# EAGLE design controllerplatine (EAGLE 9.6.2)

## Sheet 1 of 2
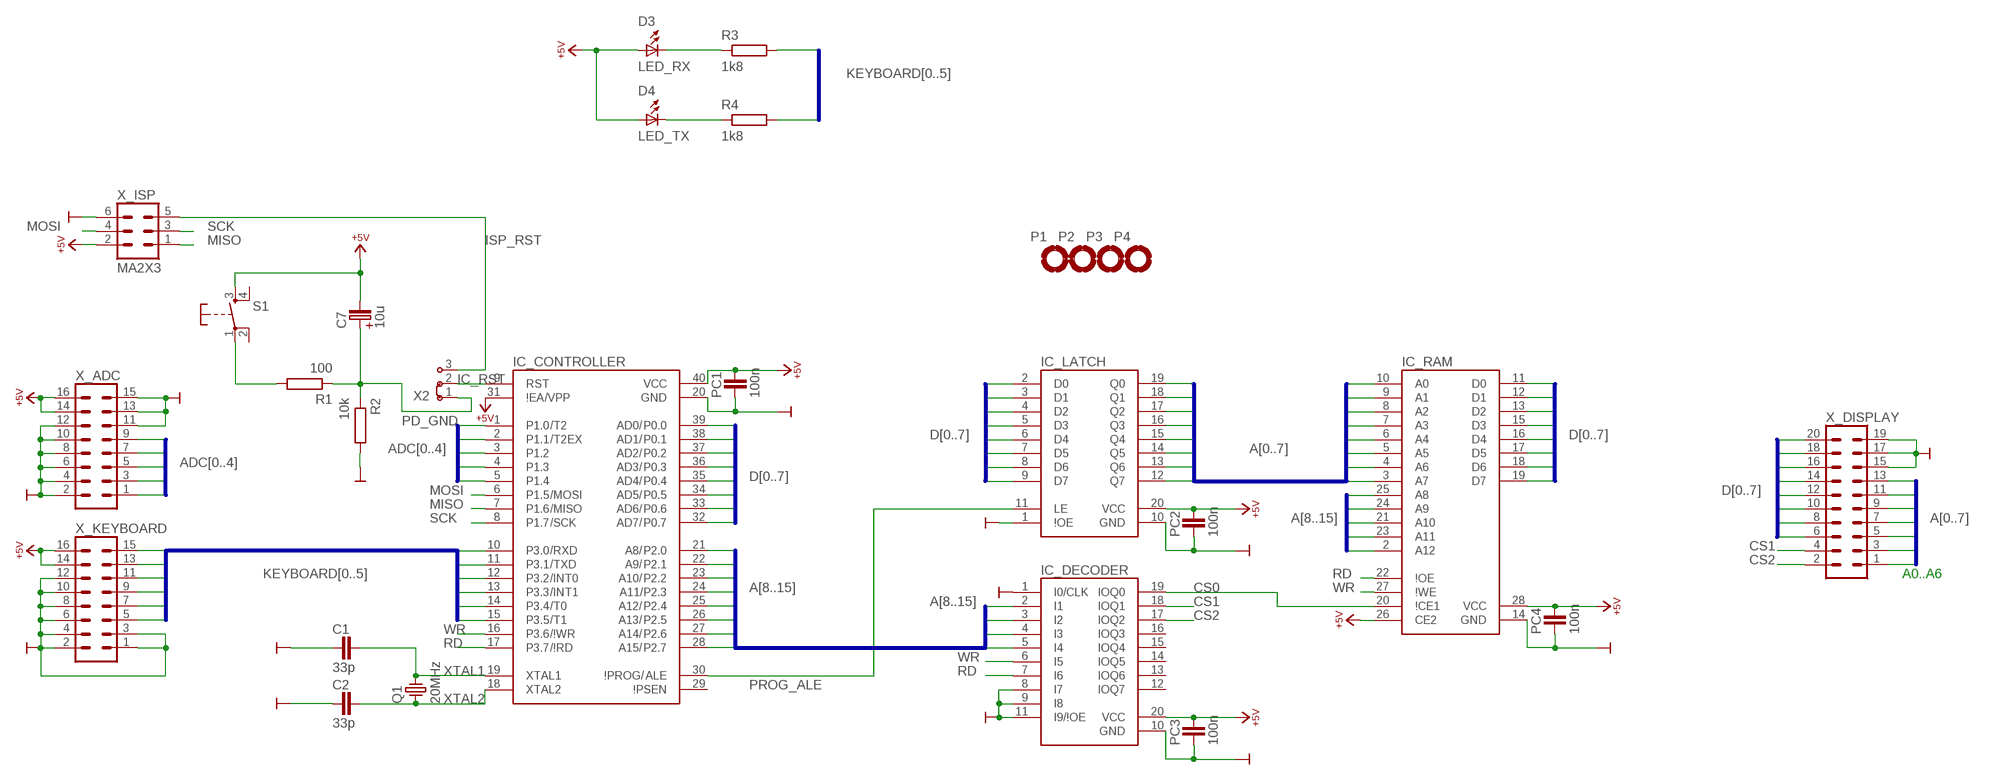
[diagram p0: schematic, sheet 1]

### Parts
C1  33p  C-2,5  [C-2,5]
C2  33p  C-2,5  [C-2,5]
C7  10u  ELKO-2,5  [ELKO-2,5]
D3  LED_RX  LED3-2,5  [LED3-2,5]
D4  LED_TX  LED3-2,5  [LED3-2,5]
IC_CONTROLLER  AT89S52  [DIL40]
IC_DECODER  16V8  [DIL20]
IC_LATCH  74573  [DIL20]
IC_RAM  6264  [DIL28]
P1  MPAD-3,0  [MPAD-3,0]
P2  MPAD-3,0  [MPAD-3,0]
P3  MPAD-3,0  [MPAD-3,0]
P4  MPAD-3,0  [MPAD-3,0]
PC1  100n  C-2,5  [C-2,5]
PC2  100n  C-2,5  [C-2,5]
PC3  100n  C-2,5  [C-2,5]
PC4  100n  C-2,5  [C-2,5]
Q1  20MHz  Q-HC49U  [HC49U]
R1  100  R-10  [R-10]
R2  10k  R-10  [R-10]
R3  1k8  R-10_LANG  [R-10_LANG]
R4  1k8  R-10_LANG  [R-10_LANG]
S1  KEY-3301  [T3301]
X2  J1X3  [J1X3]
X_ADC  MA8X2  [MA8X2]
X_DISPLAY  MA10X2  [MA10X2]
X_ISP  MA2X3  MA3X2  [MA3X2]
X_KEYBOARD  MA8X2  [MA8X2]

### Nets
+5V: C7.- D3.A D4.A IC_CONTROLLER.31(\!EA) IC_CONTROLLER.40(VCC) IC_DECODER.20(VCC) IC_LATCH.20(VCC) IC_RAM.26(CE2) IC_RAM.28(VCC) PC1.2 PC2.2 PC3.2 PC4.2 S1.3(S) X_ADC.14 X_ADC.16 X_ISP.2 X_KEYBOARD.14 X_KEYBOARD.16 ; also sheet 2
A0: IC_LATCH.19(Q0) IC_RAM.10(A0) X_DISPLAY.13
A1: IC_LATCH.18(Q1) IC_RAM.9(A1) X_DISPLAY.11
A2: IC_LATCH.17(Q2) IC_RAM.8(A2) X_DISPLAY.9
A3: IC_LATCH.16(Q3) IC_RAM.7(A3) X_DISPLAY.7
A4: IC_LATCH.15(Q4) IC_RAM.6(A4) X_DISPLAY.5
A5: IC_LATCH.14(Q5) IC_RAM.5(A5) X_DISPLAY.3
A6: IC_LATCH.13(Q6) IC_RAM.4(A6) X_DISPLAY.1
A7: IC_LATCH.12(Q7) IC_RAM.3(A7)
A8: IC_CONTROLLER.21(P2.0) IC_RAM.25(A8)
A9: IC_CONTROLLER.22(P2.1) IC_RAM.24(A9)
A10: IC_CONTROLLER.23(P2.2) IC_RAM.21(A10)
A11: IC_CONTROLLER.24(P2.3) IC_RAM.23(A11)
A12: IC_CONTROLLER.25(P2.4) IC_DECODER.5(I4) IC_RAM.2(A12)
A13: IC_CONTROLLER.26(P2.5) IC_DECODER.4(I3)
A14: IC_CONTROLLER.27(P2.6) IC_DECODER.3(I2)
A15: IC_CONTROLLER.28(P2.7) IC_DECODER.2(I1)
ADC0: IC_CONTROLLER.1(P1.0) X_ADC.9
ADC1: IC_CONTROLLER.2(P1.1) X_ADC.7
ADC2: IC_CONTROLLER.3(P1.2) X_ADC.5
ADC3: IC_CONTROLLER.4(P1.3) X_ADC.3
ADC4: IC_CONTROLLER.5(P1.4) X_ADC.1
CS0: IC_DECODER.19(IOQ0) IC_RAM.20(\!CE1)
CS1: IC_DECODER.18(IOQ1) X_DISPLAY.4
CS2: IC_DECODER.17(IOQ2) X_DISPLAY.2
D0: IC_CONTROLLER.39(P0.0) IC_LATCH.2(D0) IC_RAM.11(D0) X_DISPLAY.20
D1: IC_CONTROLLER.38(P0.1) IC_LATCH.3(D1) IC_RAM.12(D1) X_DISPLAY.18
D2: IC_CONTROLLER.37(P0.2) IC_LATCH.4(D2) IC_RAM.13(D2) X_DISPLAY.16
D3: IC_CONTROLLER.36(P0.3) IC_LATCH.5(D3) IC_RAM.15(D3) X_DISPLAY.14
D4: IC_CONTROLLER.35(P0.4) IC_LATCH.6(D4) IC_RAM.16(D4) X_DISPLAY.12
D5: IC_CONTROLLER.34(P0.5) IC_LATCH.7(D5) IC_RAM.17(D5) X_DISPLAY.10
D6: IC_CONTROLLER.33(P0.6) IC_LATCH.8(D6) IC_RAM.18(D6) X_DISPLAY.8
D7: IC_CONTROLLER.32(P0.7) IC_LATCH.9(D7) IC_RAM.19(D7) X_DISPLAY.6
GND: C1.1 C2.1 IC_CONTROLLER.20(GND) IC_DECODER.1(I0/CLK) IC_DECODER.8(I7) IC_DECODER.9(I8) IC_DECODER.10(GND) IC_DECODER.11(I9/\!OE) IC_LATCH.1(\!OE) IC_LATCH.10(GND) IC_RAM.14(GND) PC1.1 PC2.1 PC3.1 PC4.1 R2.2 X_ADC.2 X_ADC.4 X_ADC.6 X_ADC.8 X_ADC.10 X_ADC.11 X_ADC.12 X_ADC.13 X_ADC.15 X_DISPLAY.15 X_DISPLAY.17 X_DISPLAY.19 X_ISP.6 X_KEYBOARD.1 X_KEYBOARD.2 X_KEYBOARD.3 X_KEYBOARD.4 X_KEYBOARD.6 X_KEYBOARD.8 X_KEYBOARD.10 X_KEYBOARD.12 ; also sheet 2
IC_RST: IC_CONTROLLER.9(RST) X2.2
ISP_RST: X2.3 X_ISP.5
KEYBOARD0: IC_CONTROLLER.10(P3.0) R3.2 X_KEYBOARD.15
KEYBOARD1: IC_CONTROLLER.11(P3.1) R4.2 X_KEYBOARD.13
KEYBOARD2: IC_CONTROLLER.12(P3.2) X_KEYBOARD.11
KEYBOARD3: IC_CONTROLLER.13(P3.3) X_KEYBOARD.9
KEYBOARD4: IC_CONTROLLER.14(P3.4) X_KEYBOARD.7
KEYBOARD5: IC_CONTROLLER.15(P3.5) X_KEYBOARD.5
MISO: IC_CONTROLLER.7(P1.6) X_ISP.1
MOSI: IC_CONTROLLER.6(P1.5) X_ISP.4
N$7: R1.2 S1.1(P)
N$11: D3.C R3.1
N$12: D4.C R4.1
PD_GND: C7.+ R1.1 R2.1 X2.1
PROG_ALE: IC_CONTROLLER.30(ALE) IC_LATCH.11(LE)
RD: IC_CONTROLLER.17(P3.7) IC_DECODER.7(I6) IC_RAM.22(\!OE)
SCK: IC_CONTROLLER.8(P1.7) X_ISP.3
WR: IC_CONTROLLER.16(P3.6) IC_DECODER.6(I5) IC_RAM.27(\!WE)
XTAL1: C1.2 IC_CONTROLLER.19(XTAL1) Q1.2
XTAL2: C2.2 IC_CONTROLLER.18(XTAL2) Q1.1
Unconnected: IC_CONTROLLER.29(\!PSEN) IC_DECODER.12(IOQ7) IC_DECODER.13(IOQ6) IC_DECODER.14(IOQ5) IC_DECODER.15(IOQ4) IC_DECODER.16(IOQ3) P1.B3,0(MOUNT) P2.B3,0(MOUNT) P3.B3,0(MOUNT) P4.B3,0(MOUNT) S1.2(P) S1.4(S)

### Buses
D[0..7]
A[8..15]
A[0..7]
KEYBOARD[0..5]
ADC[0..4]

### Notes on the sheet
- A0..A6

## Sheet 2 of 2: Spannungsversorgung
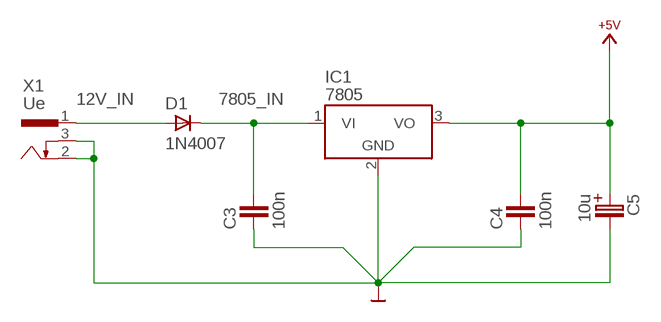
[diagram p1: schematic, sheet 2]

### Parts
C3  100n  C-2,5  [C-2,5]
C4  100n  C-2,5  [C-2,5]
C5  10u  ELKO-2,5  [ELKO-2,5]
D1  1N4007  1N4007-10  [DO41-10]
IC1  7805  [TO220V]
X1  Ue  PWRCON-HEBW21  [HEBW21]

### Nets
12V_IN: D1.A X1.1
7805_IN: C3.2 D1.C IC1.1(VI)
+5V: C4.2 C5.+ IC1.3(VO) ; also sheet 1
GND: C3.1 C4.1 C5.- IC1.2(GND) X1.2 X1.3 ; also sheet 1

## Library data of the parts
C1-C4 PC1-PC4 = 89S52mini:C-2,5
C5 C7 = 89S52mini:ELKO-2,5
D1 = 89S52mini:1N4007-10
D3 D4 = 89S52mini:LED3-2,5
IC1 = 89S52mini:7805
IC_CONTROLLER = 89S52mini:AT89S52
IC_DECODER = 89S52mini:16V8
IC_LATCH = 89S52mini:74573
IC_RAM = 89S52mini:6264
P1-P4 = 89S52mini:MPAD-3,0
Q1 = 89S52mini:Q-HC49U
R1 R2 = 89S52mini:R-10
R3 R4 = 89S52mini:R-10_LANG
S1 = 89S52mini:KEY-3301
X1 = 89S52mini:PWRCON-HEBW21
X2 = 89S52mini:J1X3
X_ADC X_KEYBOARD = 89S52mini:MA8X2
X_DISPLAY = 89S52mini:MA10X2
X_ISP = 89S52mini:MA3X2

## Board
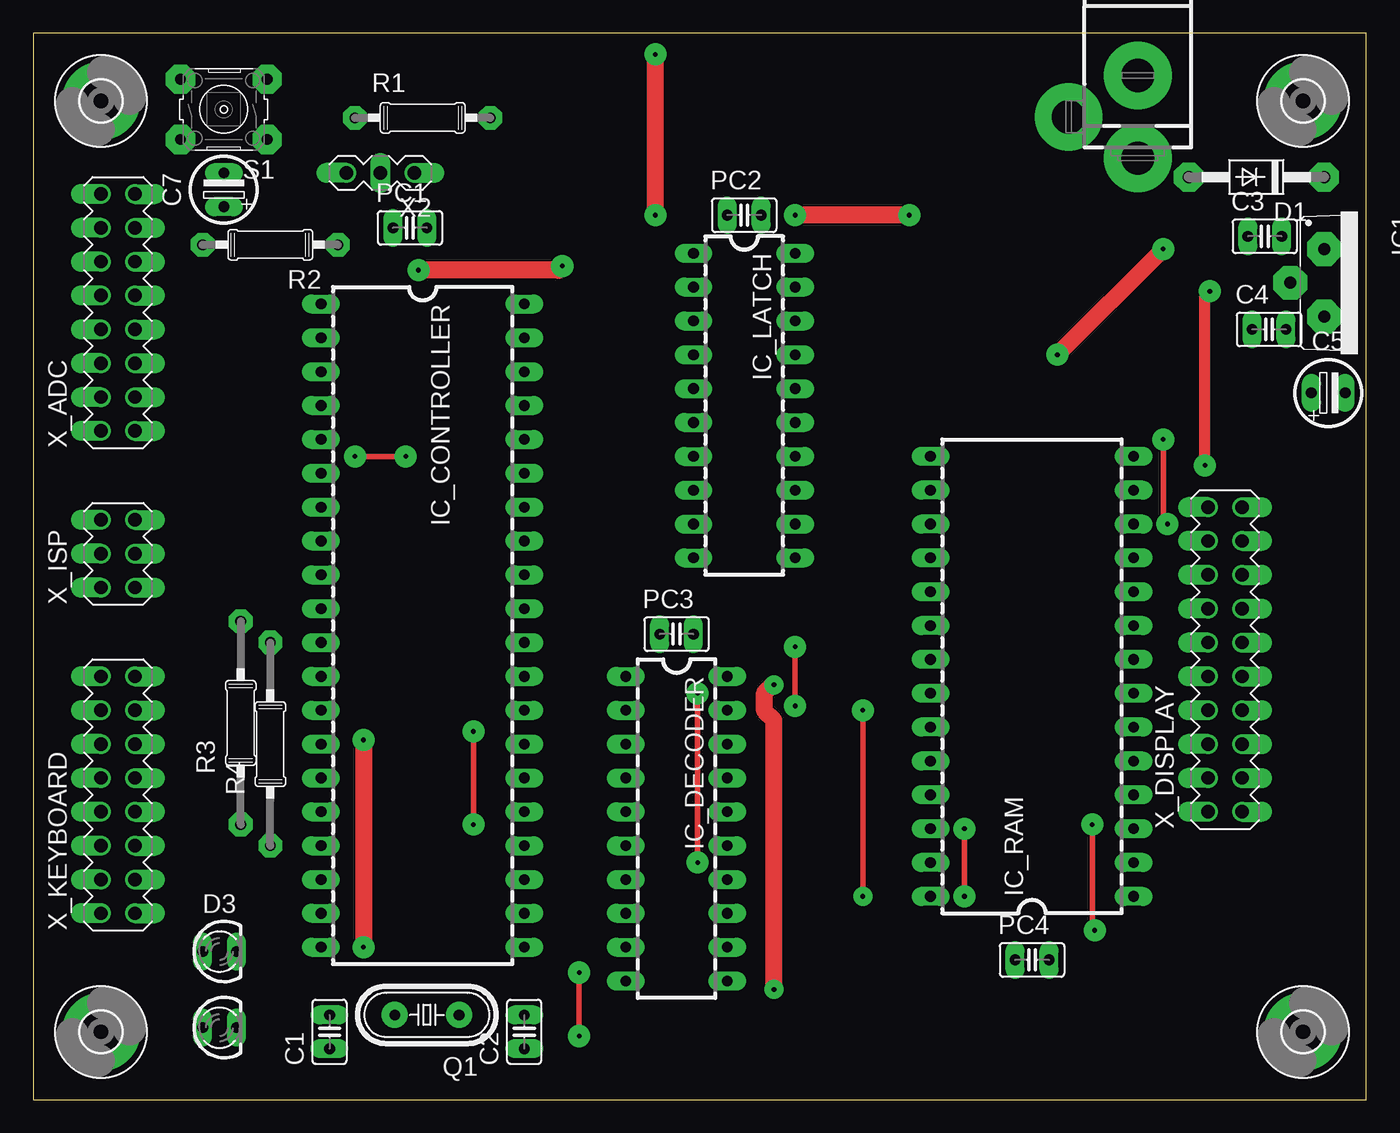
[diagram p2: board, top side]
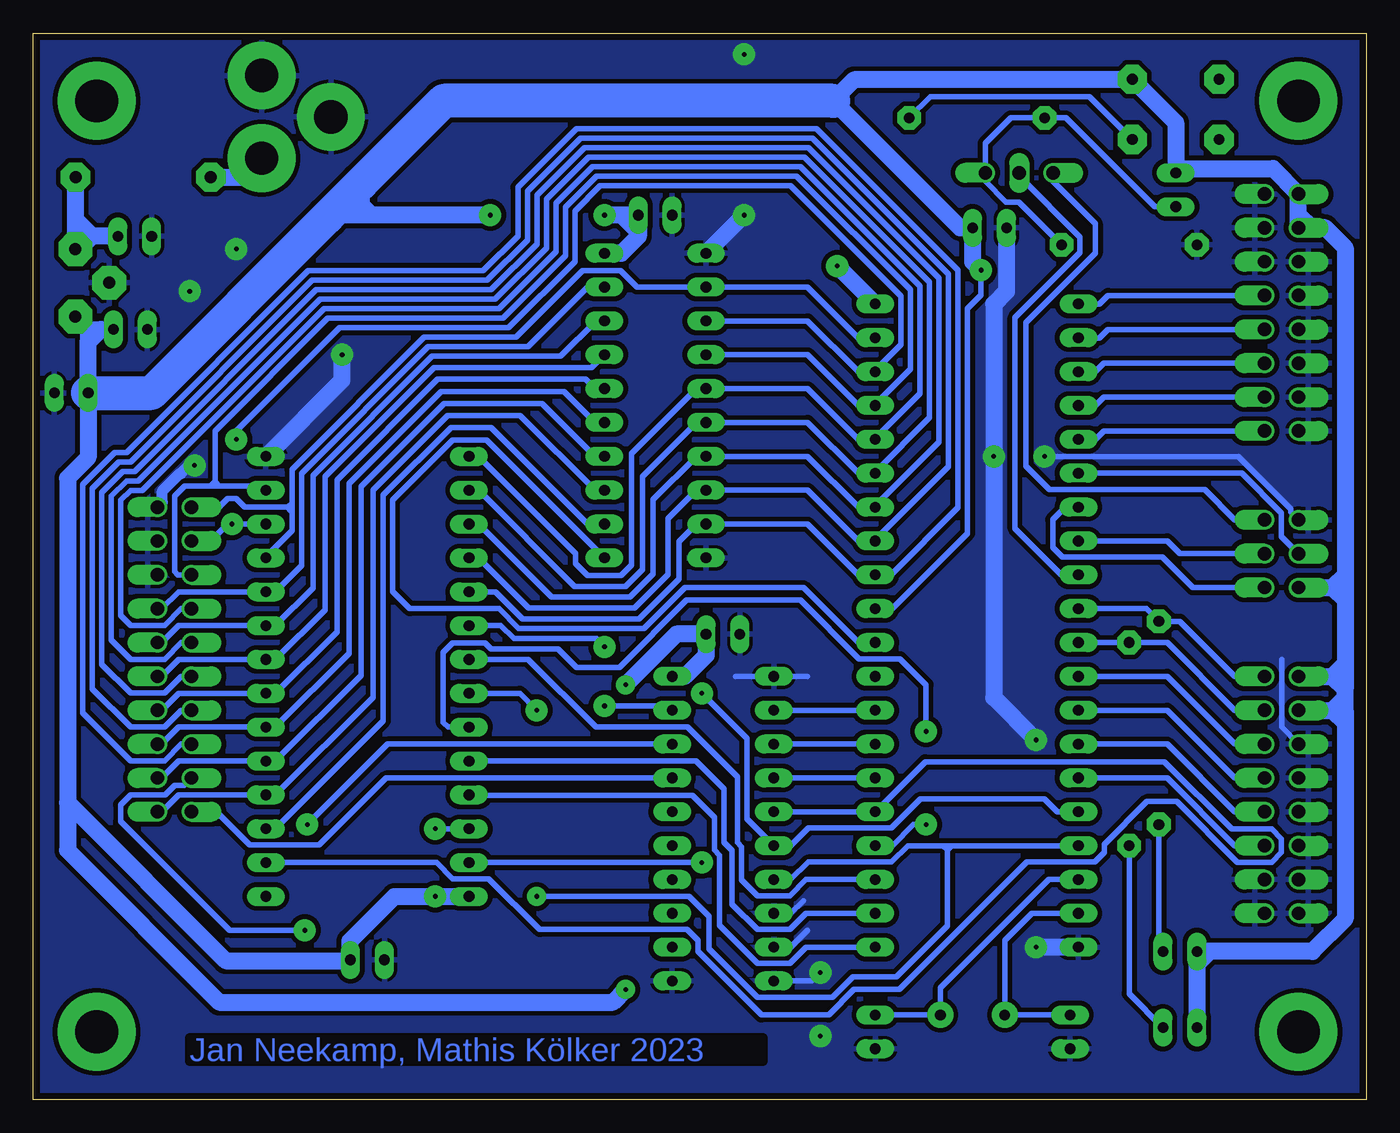
[diagram p3: board, bottom side, seen from below]

Size 100 x 80 mm. Coordinates in mm from the lower left corner, seen from the top.
Outline: 0,0 100,0 100,80 0,80 0,0
Copper layers (1*16): Top 0.035mm / dielectric 1.5mm / Bottom 0.035mm
Design rules "default *": minimum track width 16mil, minimum drill 0.35mm, track to track 12mil, track to pad 12mil, pad to pad 12mil, via to via 16mil, smd to smd 6mil, copper to edge 20mil, drill to drill 6mil, minimum pad ring 10mil, minimum via ring 8mil, stop-mask expansion 4mil, vias tented up to drill 0mil, thermal gap 10mil

### Footprints (pad centres in the part's own frame; a part is rotated, then mirrored left to right if it is on the bottom)
C-2,5 = drill 0.8 pad 1.422 long: 1 -1.27,0; 2 1.27,0
ELKO-2,5 = drill 0.8 pad 1.422 long: + -1.27,0; - 1.27,0
DO41-10 = drill 0.9 pad 2.184 octagon: A 5.08,0; C -5.08,0
LED3-2,5 = drill 0.8 pad 1.422 long: A -1.27,0; C 1.27,0
TO220V = drill 0.9 pad 2.54 octagon: 1 -2.54,0; 2 0,-2.54; 3 2.54,0
DIL40 = drill 0.8 pad 1.422 long: 1 -24.13,-7.62; 2 -21.59,-7.62; 3 -19.05,-7.62; 4 -16.51,-7.62; 5 -13.97,-7.62; 6 -11.43,-7.62; 7 -8.89,-7.62; 8 -6.35,-7.62; 9 -3.81,-7.62; 10 -1.27,-7.62; 11 1.27,-7.62; 12 3.81,-7.62; 13 6.35,-7.62; 14 8.89,-7.62; 15 11.43,-7.62; 16 13.97,-7.62; 17 16.51,-7.62; 18 19.05,-7.62; 19 21.59,-7.62; 20 24.13,-7.62; 21 24.13,7.62; 22 21.59,7.62; 23 19.05,7.62; 24 16.51,7.62; 25 13.97,7.62; 26 11.43,7.62; 27 8.89,7.62; 28 6.35,7.62; 29 3.81,7.62; 30 1.27,7.62; 31 -1.27,7.62; 32 -3.81,7.62; 33 -6.35,7.62; 34 -8.89,7.62; 35 -11.43,7.62; 36 -13.97,7.62; 37 -16.51,7.62; 38 -19.05,7.62; 39 -21.59,7.62; 40 -24.13,7.62
DIL20 = drill 0.8 pad 1.422 long: 1 -11.43,-3.81; 2 -8.89,-3.81; 3 -6.35,-3.81; 4 -3.81,-3.81; 5 -1.27,-3.81; 6 1.27,-3.81; 7 3.81,-3.81; 8 6.35,-3.81; 9 8.89,-3.81; 10 11.43,-3.81; 11 11.43,3.81; 12 8.89,3.81; 13 6.35,3.81; 14 3.81,3.81; 15 1.27,3.81; 16 -1.27,3.81; 17 -3.81,3.81; 18 -6.35,3.81; 19 -8.89,3.81; 20 -11.43,3.81
DIL28 = drill 0.8 pad 1.422 long: 1 -16.51,-7.62; 2 -13.97,-7.62; 3 -11.43,-7.62; 4 -8.89,-7.62; 5 -6.35,-7.62; 6 -3.81,-7.62; 7 -1.27,-7.62; 8 1.27,-7.62; 9 3.81,-7.62; 10 6.35,-7.62; 11 8.89,-7.62; 12 11.43,-7.62; 13 13.97,-7.62; 14 16.51,-7.62; 15 16.51,7.62; 16 13.97,7.62; 17 11.43,7.62; 18 8.89,7.62; 19 6.35,7.62; 20 3.81,7.62; 21 1.27,7.62; 22 -1.27,7.62; 23 -3.81,7.62; 24 -6.35,7.62; 25 -8.89,7.62; 26 -11.43,7.62; 27 -13.97,7.62; 28 -16.51,7.62
MPAD-3,0 = drill 3.2 pad 5.842: B3,0 0,0
HC49U = drill 0.8 pad 1.93: 1 -2.413,0; 2 2.413,0
R-10 = drill 0.8 pad 1.778 octagon: 1 -5.08,0; 2 5.08,0
R-10_LANG = drill 0.8 pad 1.778 octagon: 1 -7.62,0; 2 7.62,0
T3301 = drill 0.8 pad 2.184 octagon: 1 -3.251,2.261; 2 3.251,2.261; 3 -3.251,-2.261; 4 3.251,-2.261
HEBW21 = drill 2.5 pad 5.08: 1 6.2,0; 2 3.1,-5.2; 3 0,0
J1X3 = drill 1 pad 1.422 offset: 1 -2.54,0; 3 2.54,0 | drill 1 pad 1.422 long: 2 0,0
MA8X2 = drill 1 pad 1.422 offset: 1 -8.89,-1.27; 2 -8.89,1.27; 3 -6.35,-1.27; 4 -6.35,1.27; 5 -3.81,-1.27; 6 -3.81,1.27; 7 -1.27,-1.27; 8 -1.27,1.27; 9 1.27,-1.27; 10 1.27,1.27; 11 3.81,-1.27; 12 3.81,1.27; 13 6.35,-1.27; 14 6.35,1.27; 15 8.89,-1.27; 16 8.89,1.27
MA10X2 = drill 1 pad 1.422 offset: 1 -11.43,-1.27; 2 -11.43,1.27; 3 -8.89,-1.27; 4 -8.89,1.27; 5 -6.35,-1.27; 6 -6.35,1.27; 7 -3.81,-1.27; 8 -3.81,1.27; 9 -1.27,-1.27; 10 -1.27,1.27; 11 1.27,-1.27; 12 1.27,1.27; 13 3.81,-1.27; 14 3.81,1.27; 15 6.35,-1.27; 16 6.35,1.27; 17 8.89,-1.27; 18 8.89,1.27; 19 11.43,-1.27; 20 11.43,1.27
MA3X2 = drill 1 pad 1.422 offset: 1 -2.54,-1.27; 2 -2.54,1.27; 3 0,-1.27; 4 0,1.27; 5 2.54,-1.27; 6 2.54,1.27

### Placement (x,y rotation side)
C1  22.23,5.08 90 top
C2  36.83,5.08 90 top
C3  92.39,64.77 0 top
C4  92.71,57.78 0 top
C5  97.16,53.02 0 top
C7  14.29,68.26 90 top
D1  91.76,69.22 180 top
D3  13.97,11.11 0 top
D4  13.97,5.4 0 top
IC1  96.84,61.28 270 top
IC_CONTROLLER  29.21,35.56 270 top
IC_DECODER  48.26,20.32 270 top
IC_LATCH  53.34,52.07 270 top
IC_RAM  74.93,31.75 90 top
P1  95.25,5.08 0 top
P2  5.08,5.08 0 top
P3  5.08,74.93 0 top
P4  95.25,74.93 0 top
PC1  28.26,65.41 0 top
PC2  53.34,66.36 0 top
PC3  48.26,34.92 0 top
PC4  74.93,10.48 0 top
Q1  29.53,6.35 180 top
R1  29.21,73.66 0 top
R2  17.78,64.14 180 top
R3  15.56,28.26 90 top
R4  17.78,26.67 90 top
S1  14.29,74.3 180 top
X1  82.87,76.83 270 top
X2  26.04,69.53 180 top
X_ADC  6.35,59.05 90 top
X_DISPLAY  89.41,33.02 90 top
X_ISP  6.35,40.96 90 top
X_KEYBOARD  6.35,22.86 90 top

### Tracks (layer width: path | path; a pad name or v marks a point on that pad's centre or on a via)
12V_IN
  Bottom 1.27: D1.A 84.29,69.22 X1.1
7805_IN
  Bottom 1.27: D1.C 96.84,66.04 | 96.84,66.04 96.84,64.77 | 96.84,64.77 IC1.1 96.52,63.82 95.57,64.77 | C3.2 95.57,64.77 | 96.84,64.77 95.57,64.77 | 96.84,66.04 95.57,64.77
+5V  (via drill 0.35 pad 1.42, 0.35 pad 1.65)
  Top 0.406: v69.85,20.32 v69.85,15.24
  Top 1.27: v39.69,62.55 39.37,62.23 v28.89,62.23 | v65.72,66.36 v57.15,66.36 | v55.56,8.26 55.56,28.46 54.86,29.16 54.86,30.53 55.45,31.11 v55.56,31.11
  Bottom 0.406: v69.85,20.32 IC_RAM.26 | v28.89,62.23 28.89,60.35 29.91,59.34 29.91,42.48 35.56,36.83 IC_CONTROLLER.31
  Bottom 1.27: IC1.3 95.89,57.78 | 95.89,57.78 94.93,57.78 | 94.93,57.78 C4.2 | 95.89,56.83 C5.+ 95.89,48.17 97.44,46.62 97.44,22.29 | 95.89,57.78 95.89,56.83 | 94.93,57.78 95.89,56.83 | 5.08,66.36 X_ADC.14 4.13,65.41 | 5.08,66.36 X_ADC.16 6.99,69.85 13.97,69.85 C7.- 14.29,73.3 S1.3 17.58,76.52 38.42,76.52 40.01,74.93 30.48,65.41 PC1.2 29.53,62.87 v28.89,62.23 | 1.59,39.37 1.59,63.91 3.08,65.41 4.13,65.41 | 1.59,39.37 1.59,38.42 | 1.59,38.42 1.59,37.47 | X_ISP.2 2.54,38.42 | 2.54,38.42 1.59,38.42 | 1.59,39.37 2.54,38.42 | 2.54,38.42 1.59,37.47 | 5.08,66.36 4.13,65.41 | 1.59,37.47 1.59,32.7 | 1.59,32.7 1.59,31.75 | 1.59,31.75 1.59,30.8 | 1.59,29.21 1.59,30.16 | 1.59,29.21 1.59,28.26 | 1.59,28.26 1.59,13.56 4.03,11.11 11.75,11.11 | 1.59,31.75 2.54,31.75 | X_KEYBOARD.16 2.54,31.75 | 1.59,29.21 2.54,29.21 | X_KEYBOARD.14 2.54,29.21 | 2.54,29.21 1.59,30.16 | 1.59,30.16 1.59,30.8 | 1.59,30.8 2.54,31.75 | 2.54,31.75 1.59,32.7 | 2.54,29.21 1.59,28.26 | 11.75,11.11 D3.A 12.7,10.16 | 12.7,10.16 D4.A | 11.75,11.11 12.7,10.16 | IC_CONTROLLER.40 v39.69,62.55 | 54.61,65.41 PC2.2 55.88,66.36 | 54.61,65.41 54.61,64.77 55.88,63.5 IC_LATCH.20 | 55.88,66.36 v57.15,66.36 | 55.88,66.36 54.93,65.41 54.61,65.41 | v65.72,66.36 74.61,66.36 | IC_RAM.28 v69.85,15.24 72.9,15.24 76.26,11.87 76.26,10.54 PC4.2 76.2,10.41 85.56,10.41 97.44,22.29 | IC_DECODER.20 51.12,31.75 49.53,33.34 PC3.2 51.75,34.92 v55.56,31.11 | v55.56,8.26 56.52,7.3 86.04,7.3 97.44,18.7 97.44,22.29 | 75.41,68.74 75.41,67.15 74.61,66.36 | 74.61,66.36 77.79,66.36 77.95,66.2
  Bottom 2.54: C5.+ 91.12,53.02 77.95,66.2 75.41,68.74 69.22,74.93 40.01,74.93
A0
  Bottom 0.406: X_DISPLAY.13 90.36,36.83 89.09,38.1 IC_RAM.10 81.84,38.1 79.88,40.06 79.88,46.98 70.37,56.49 62.89,56.49 58.42,60.96 IC_LATCH.19
A1
  Bottom 0.406: X_DISPLAY.11 90.36,34.29 89.09,35.56 IC_RAM.9 81.84,35.56 79.02,38.38 79.02,46.83 70.08,55.78 60.43,55.78 57.78,58.42 IC_LATCH.18
A2
  Bottom 0.406: X_DISPLAY.9 90.36,31.75 89.09,33.02 IC_RAM.8 81.84,33.02 78.12,36.74 78.12,46.73 69.92,54.93 58.1,54.93 IC_LATCH.17
A3
  Bottom 0.406: IC_LATCH.16 57.86,53.34 58.56,54.04 69.66,54.04 77.22,46.48 77.22,35.1 81.84,30.48 IC_RAM.7 89.09,30.48 90.36,29.21 X_DISPLAY.7
A4
  Bottom 0.406: IC_LATCH.15 57.86,50.8 60.2,53.14 69.41,53.14 76.32,46.23 76.32,33.46 81.84,27.94 IC_RAM.6 89.09,27.94 90.36,26.67 X_DISPLAY.5
A5
  Bottom 0.406: IC_LATCH.14 57.86,48.26 61.84,52.23 69.17,52.23 75.42,45.98 75.42,31.82 81.84,25.4 IC_RAM.5 89.09,25.4 90.36,24.13 X_DISPLAY.3
A6
  Bottom 0.406: IC_LATCH.13 57.86,45.72 63.48,51.33 68.92,51.33 74.52,45.73 74.52,30.18 81.84,22.86 IC_RAM.4 89.09,22.86 90.36,21.59 X_DISPLAY.1
A7
  Bottom 0.406: IC_RAM.3 81.84,20.32 73.75,28.41 73.75,45.35 68.67,50.43 65.67,50.43 58.42,43.18 IC_LATCH.12
A8
  Bottom 0.406: IC_CONTROLLER.21 42.02,11.43 43.23,10.21 45.67,10.21 48.51,13.06 48.51,18.33 48.9,18.71 48.9,21.17 50.54,22.81 67.26,22.81 IC_RAM.25
A9
  Bottom 0.406: IC_RAM.24 50.27,25.4 48.18,23.31 48.18,19.29 47.57,18.68 47.57,14.65 45.67,12.75 43.23,12.75 42.02,13.97 IC_CONTROLLER.22
A10
  Bottom 0.406: IC_CONTROLLER.23 42.02,16.51 43.23,15.29 45.67,15.29 46.86,16.48 46.86,18.97 47.17,19.29 47.17,24.21 50.91,27.94 57.78,27.94 62.87,33.02 IC_RAM.21
A11  (via drill 0.35 pad 1.65)
  Top 0.406: v33.02,27.62 v33.02,20.64
  Bottom 0.406: IC_RAM.23 68.9,27.94 69.24,28.28 69.24,33.52 68.53,34.24 66.09,34.24 65.67,33.81 60.62,33.81 59.24,32.44 56.01,32.44 50.98,37.47 42.44,37.47 38.05,33.07 34.98,33.07 33.02,31.11 v33.02,27.62 | IC_CONTROLLER.24 35.56,19.05 33.97,20.64 v33.02,20.64
A12
  Bottom 0.406: IC_DECODER.5 IC_CONTROLLER.25 33.07,25.35 15.14,25.35 10.1,20.31 7.1,20.31 6.36,19.57 6.36,18.53 7.1,17.79 9.65,17.79 14.21,22.35 16.45,22.35 19.66,19.15 19.66,18.55 20.37,17.83 25.45,17.83 35.03,8.26 38.42,8.26 40.32,6.35 45.38,6.35 50.14,11.11 50.14,11.94 50.95,12.75 62.02,12.75 65.83,16.56 68.53,16.56 69.75,17.78 IC_RAM.2
A13
  Bottom 0.406: IC_CONTROLLER.26 IC_DECODER.4
A14
  Bottom 0.406: IC_DECODER.3 IC_CONTROLLER.27
A15
  Bottom 0.406: IC_CONTROLLER.28 IC_DECODER.2
ADC0
  Bottom 0.406: IC_CONTROLLER.1 20,59.69 19.37,60.33 X_ADC.9
ADC1
  Bottom 0.406: IC_CONTROLLER.2 20,57.15 19.37,57.78 X_ADC.7
ADC2
  Bottom 0.406: IC_CONTROLLER.3 20.32,54.61 19.68,55.24 X_ADC.5
ADC3
  Bottom 0.406: IC_CONTROLLER.4 20.32,52.07 19.68,52.7 X_ADC.3
ADC4
  Bottom 0.406: IC_CONTROLLER.5 20.32,49.53 19.68,50.16 X_ADC.1
CS0  (via drill 0.35 pad 1.65)
  Top 0.406: v57.15,33.97 v57.15,29.53
  Bottom 0.406: v57.15,29.53 52.39,29.53 IC_DECODER.19 | IC_RAM.20 64.93,35.56 63.94,34.58 57.75,34.58 v57.15,33.97
CS1  (via drill 0.35 pad 1.65)
  Top 0.406: v79.44,20.64 79.44,12.89 v79.63,12.7
  Bottom 0.406: IC_DECODER.18 73.41,26.67 v79.44,20.64 | v79.63,12.7 85.28,12.7 93.45,20.87 93.45,22.11 92.71,22.85 90.1,22.85 89.39,23.57 88.7,23.57 X_DISPLAY.4
CS2
  Bottom 0.406: IC_DECODER.17 73.51,24.13 78.54,19.1 83.77,19.1 86.25,21.59 X_DISPLAY.2
D0
  Bottom 0.406: IC_CONTROLLER.39 38.1,57.15 41.91,60.96 IC_LATCH.2 54.72,60.96 55.93,62.18 58.79,62.18 63.77,57.2 70.68,57.2 80.59,47.28 80.59,44.77 | 80.59,44.13 80.59,42.7 82.55,40.74 IC_RAM.11 | 80.59,44.13 80.59,44.45 | 80.59,44.77 80.59,44.45 | 80.91,44.45 80.59,44.45 | 80.91,44.45 80.96,44.45 | 80.91,44.45 80.59,44.77 | 80.96,44.45 80.64,44.13 80.59,44.13 | X_DISPLAY.20 86.04,44.45 85.41,45.09 84.77,45.09 84.14,44.45 80.96,44.45
D1  (via drill 0.35 pad 1.65)
  Top 0.406: v84.77,49.53 84.77,43.5 v85.09,43.18
  Bottom 0.406: IC_RAM.12 v85.09,43.18 85.41,43.18 86.68,41.91 X_DISPLAY.18 | IC_LATCH.3 41.91,58.42 38.1,54.61 IC_CONTROLLER.38 36.83,54.72 34.9,56.65 34.9,60.3 43.18,68.58 57.47,68.58 59.37,66.67 59.37,62.87 64.33,57.91 77.03,57.91 84.77,50.16 v84.77,49.53
D2
  Bottom 0.406: IC_LATCH.4 41.91,55.88 38.1,52.07 IC_CONTROLLER.37 36.83,52.17 34.19,54.82 34.19,60.75 42.73,69.29 57.76,69.29 60.08,66.97 60.08,63.31 64.77,58.62 77.9,58.62 86.36,50.16 86.36,46.35 | X_DISPLAY.16 89.16,39.37 89.4,39.61 89.4,45.29 88.65,46.04 86.68,46.04 | IC_RAM.13 82.87,46.04 86.04,46.04 | 86.36,46.04 86.04,46.04 | 86.36,46.04 86.68,46.04 | 86.36,46.35 86.36,46.04 | 86.36,46.35 86.68,46.04 | 86.04,46.04 86.36,46.35
D3
  Bottom 0.406: IC_RAM.15 66.6,48.26 59.32,40.98 59.32,40.23 58.41,39.32 55.89,39.32 55.12,40.09 55.12,48.46 50.24,53.34 IC_LATCH.5 41.91,53.34 38.1,49.53 IC_CONTROLLER.36 36.83,49.63 33.48,52.99 33.48,61.05 42.43,70 58.06,70 60.8,67.26 60.8,63.6 65.06,59.33 78.2,59.33 91.82,45.71 92.71,45.71 93.45,44.97 93.45,36.31 92.71,35.57 90.16,35.57 88.89,36.83 X_DISPLAY.14
D4
  Bottom 0.406: IC_RAM.16 66.6,45.72 59.38,38.51 55.55,38.51 54.3,39.76 54.3,46.74 50.24,50.8 IC_LATCH.6 41.91,50.8 38.1,46.99 IC_CONTROLLER.35 36.83,47.09 32.77,51.16 32.77,61.34 42.14,70.71 58.35,70.71 61.51,67.56 61.51,63.9 65.36,60.05 78.49,60.05 92.11,46.42 93,46.42 94.16,45.27 94.16,34.48 92.71,33.03 90.16,33.03 88.89,34.29 X_DISPLAY.12
D5
  Bottom 0.406: IC_RAM.17 66.6,43.18 61.11,37.69 55.22,37.69 53.49,39.42 53.49,45.01 50.24,48.26 IC_LATCH.7 41.91,48.26 38.1,44.45 IC_CONTROLLER.34 36.83,44.55 32.05,49.33 32.05,61.64 41.84,71.42 58.65,71.42 62.22,67.85 62.22,64.19 65.65,60.76 78.79,60.76 92.41,47.13 93.3,47.13 94.87,45.56 94.87,32.65 92.71,30.49 90.16,30.49 88.89,31.75 X_DISPLAY.10
D6
  Bottom 0.406: IC_RAM.18 66.6,40.64 62.84,36.88 54.88,36.88 52.38,39.39 52.38,43.59 50.24,45.72 IC_LATCH.8 41.91,45.72 38.1,41.91 IC_CONTROLLER.33 36.83,42.02 31.34,47.5 31.34,61.93 41.55,72.14 58.94,72.14 62.93,68.15 62.93,64.49 65.95,61.47 79.08,61.47 92.7,47.85 93.59,47.85 95.58,45.86 95.58,30.82 92.71,27.95 90.16,27.95 88.89,29.21 X_DISPLAY.8
D7
  Bottom 0.406: IC_RAM.19 65.33,38.1 63.3,36.07 54.55,36.07 51.56,39.05 51.56,41.86 50.24,43.18 IC_LATCH.9 41.91,43.18 38.1,39.37 IC_CONTROLLER.32 35.66,39.37 30.63,44.4 30.63,62.23 41.25,72.85 59.23,72.85 63.64,68.44 63.64,64.78 66.24,62.18 79.38,62.18 93,48.56 93.89,48.56 96.29,46.15 96.29,28.99 92.71,25.41 90.16,25.41 88.89,26.67 X_DISPLAY.6
GND  (via drill 0.35 pad 1.65)
  Top 0.406: v40.96,9.53 v40.96,4.76 | v24.13,48.26 v27.94,48.26
  Top 0.813: v87.91,47.58 87.91,60.28 v88.27,60.64
  Top 1.27: v24.77,26.99 v24.77,11.43 | v76.83,55.88 v84.77,63.82 | v46.67,66.36 v46.67,78.42
  Bottom 0.406: X_KEYBOARD.12 6.35,27.94 6.35,33.02 | IC_DECODER.10 41.59,8.89 v40.96,9.53 | IC_DECODER.8 43.18,13.97 42.23,14.92 | IC_DECODER.9 43.18,11.43 41.91,12.7 | X_ISP.6 5.65,44.06 5.65,44.31 9.59,48.26 v24.13,48.26 | 41.91,31.75 IC_DECODER.1 47.31,31.75
  Bottom 0.813: X_DISPLAY.19 90.31,44.81 90.31,45.67 89.03,46.95 88.94,46.95 88.11,47.78 v87.91,47.58
  Bottom 1.27: IC_CONTROLLER.20 v24.77,11.43 | PC1.1 26.99,60.64 27.94,59.69 v27.94,48.26 27.94,30.16 v24.77,26.99 | IC_RAM.14 76.83,53.98 v76.83,55.88 | IC_LATCH.1 v46.67,66.36
  pour Bottom (isolate 0.356): -0.32,80.01 100.01,80.01 100.01,0 -0.32,0
IC_RST
  Bottom 0.406: IC_CONTROLLER.9 22.86,39.37 26.35,42.86 26.35,58.67 21.46,63.56 21.46,64.71 26.04,69.29 X2.2
ISP_RST
  Bottom 0.406: X_ISP.5 9.84,43.5 12.12,45.77 23.76,45.77 25.53,47.54 25.53,58.29 20.32,63.5 20.32,65.72 23.5,68.9 X2.3
KEYBOARD0
  Bottom 0.406: IC_CONTROLLER.10 16.51,36.83 R3.2 13.97,35.88 9.84,31.75 X_KEYBOARD.15
KEYBOARD1
  Bottom 0.406: IC_CONTROLLER.11 R4.2 14.92,34.29 9.84,29.21 X_KEYBOARD.13
KEYBOARD2
  Bottom 0.406: IC_CONTROLLER.12 14.92,31.75 9.84,26.67 X_KEYBOARD.11
KEYBOARD3
  Bottom 0.406: IC_CONTROLLER.13 14.92,29.21 9.84,24.13 X_KEYBOARD.9
KEYBOARD4
  Bottom 0.406: IC_CONTROLLER.14 14.92,26.67 9.84,21.59 X_KEYBOARD.7
KEYBOARD5
  Bottom 0.406: IC_CONTROLLER.15 14.92,24.13 9.84,19.05 X_KEYBOARD.5
MISO
  Bottom 0.406: X_ISP.1 13.02,38.42 15.29,40.69 22.81,40.69 23.52,41.41 23.52,43.51 22.58,44.45 IC_CONTROLLER.7
MOSI
  Bottom 0.406: X_ISP.4 6.36,42.24 6.36,44.02 9.33,46.99 IC_CONTROLLER.6
N$7
  Bottom 0.406: R1.2 32.7,75.25 20.75,75.25 S1.1
N$11
  Bottom 0.406: R3.1 15.56,11.43 D3.C
N$12
  Bottom 0.406: R4.1 17.78,7.94 D4.C
PD_GND
  Bottom 0.406: C7.+ 15.88,66.99 22.54,73.66 R1.1 26.67,73.66 28.57,71.75 28.57,69.85 X2.1 28.57,68.9 27.01,67.33 26.06,67.33 R2.1
PROG_ALE
  Bottom 0.406: IC_LATCH.11 65.99,49.48 68.53,49.48 73.04,44.97 73.04,38.11 71.75,36.83 65.06,36.83 63.59,35.36 54.18,35.36 51.12,38.42 42.23,38.42 38.1,34.29 IC_CONTROLLER.30
RD  (via drill 0.35 pad 1.42, 0.35 pad 1.65)
  Top 0.406: v62.23,15.24 v62.23,29.21
  Bottom 0.406: IC_CONTROLLER.17 31.11,19.05 | 31.11,19.05 31.43,19.05 | 31.43,19.05 31.75,19.05 | 31.75,19.05 34.4,19.05 35.61,17.83 41.86,17.83 43.18,16.51 IC_DECODER.7 | 31.43,19.05 31.43,18.73 | 31.43,18.73 31.43,13.02 35.24,9.21 38.52,9.21 40.06,7.67 45.67,7.67 49.31,11.31 49.31,13.75 50.8,15.24 v62.23,15.24 | 31.43,18.73 31.75,19.05 | 31.43,18.73 31.11,19.05 | v62.23,29.21 63.5,30.48 IC_RAM.22
SCK
  Bottom 0.406: IC_CONTROLLER.8 14.92,41.91 13.97,40.96 X_ISP.3
WR  (via drill 0.35 pad 1.65)
  Top 0.406: v49.85,17.78 v49.85,30.48
  Bottom 0.406: IC_CONTROLLER.16 23.18,21.59 24.13,22.54 33.44,22.54 35.61,20.37 41.86,20.37 43.18,19.05 IC_DECODER.6 46.46,21.06 46.46,27.09 v49.85,30.48 | IC_RAM.27 v49.85,17.78
XTAL1
  Bottom 0.406: IC_CONTROLLER.19 25.08,13.97 27.11,11.94 Q1.2 C1.2
XTAL2
  Bottom 0.406: IC_CONTROLLER.18 23.81,16.51 31.94,8.38 Q1.1 C2.2

### Text on the board
Bottom: Jan Neekamp, Mathis Kölker 2023